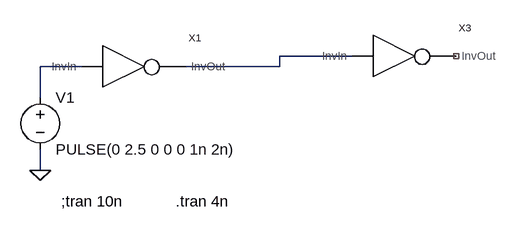
[diagram p0: schematic Draft3.asc]
Draft3.asc, the LTspice schematic file:
Version 4
SHEET 1 880 680
WIRE 544 128 432 128
WIRE 128 144 64 144
WIRE 432 144 432 128
WIRE 432 144 288 144
WIRE 64 192 64 144
WIRE 64 304 64 272
FLAG 64 304 0
SYMBOL invhw 192 144 R0
SYMATTR InstName X1
SYMBOL voltage 64 176 R0
WINDOW 123 0 0 Left 2
WINDOW 39 0 0 Left 2
SYMATTR InstName V1
SYMATTR Value PULSE(0 2.5 0 0 0 1n 2n)
SYMBOL invhw 608 128 R0
SYMATTR InstName X3
TEXT 96 352 Left 2 !;tran 10n
TEXT 272 352 Left 2 !.tran 4n

The netlist it stands for:
* Draft3.asc
XX1 N002 N001 invhw  ; pins InvIn InvOut
V1 N002 0 PULSE(0 2.5 0 0 0 1n 2n)
XX3 N001 NC_01 invhw  ; pins InvIn InvOut
;tran 10n
.tran 4n
.backanno
.end